# Altium schematic sheet 12mm_rotary_knob.SchDoc
size B; DocumentNumber: 5; SheetNumber: 5; SheetTotal: 6
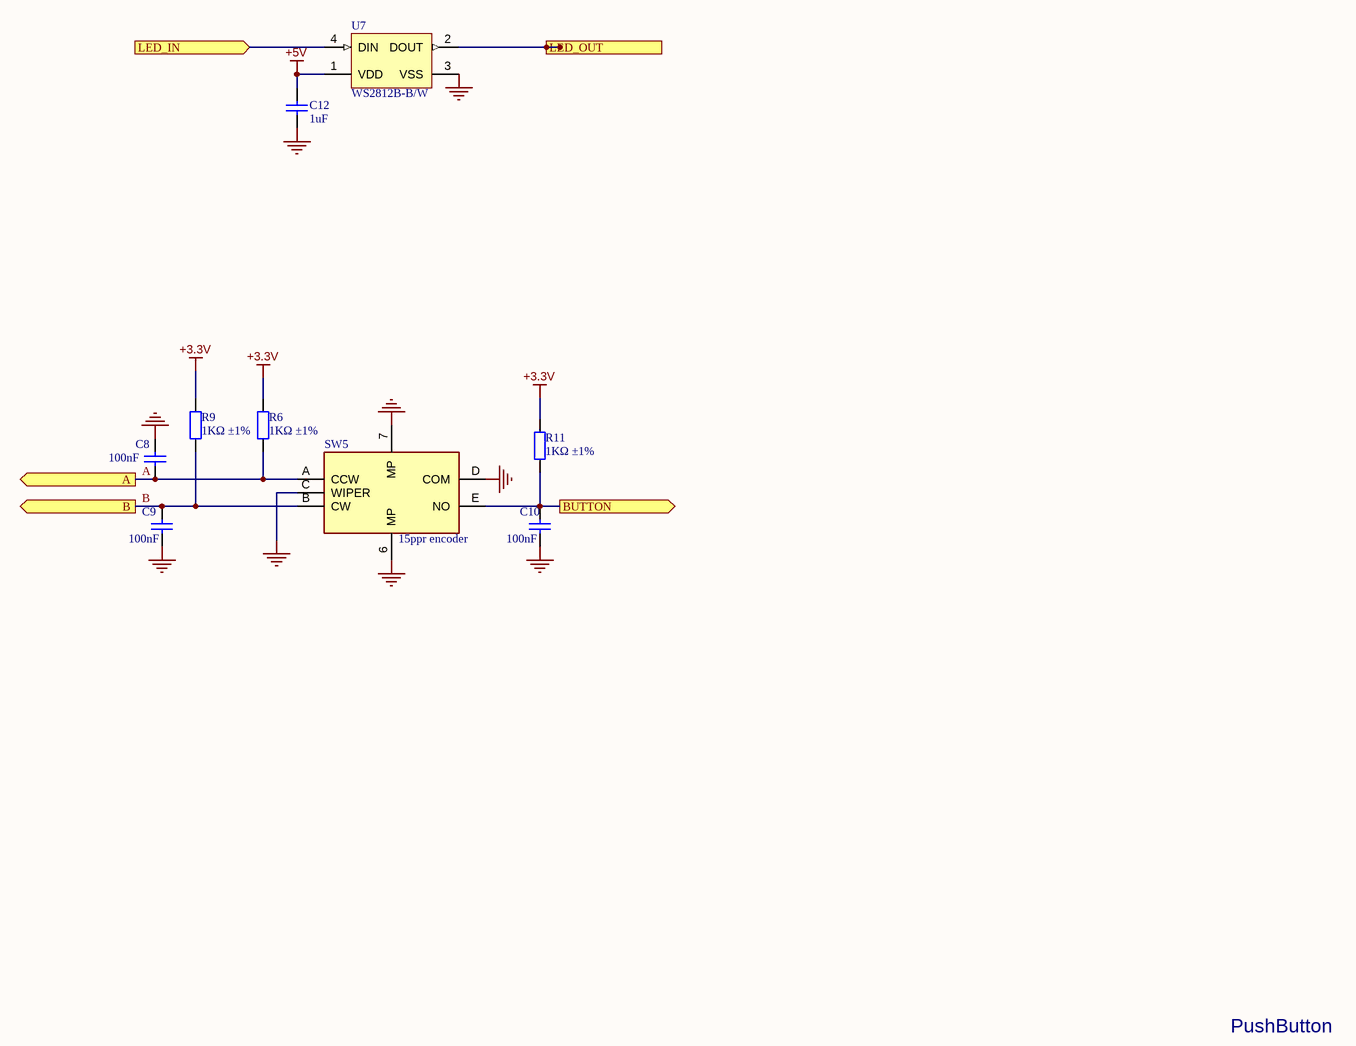
[diagram p0: 12mm_rotary_knob.SchDoc]

## Parts
C8  100nF  [0603_C]
C9  100nF  [0603_C]
C10  100nF  [0603_C]
C12  1uF  [0603_C]
R6  1KΩ ±1%  [0603_R]
R9  1KΩ ±1%  [0603_R]
R11  1KΩ ±1%  [0603_R]
SW5  15ppr encoder  [SW-TH_EC11E15244G1]
U7  WS2812B-B/W  [ADA-RGB-1655_V]

## Ports
A (out), B (out), BUTTON (out), LED_IN (in), LED_OUT (out)

## Nets
+3.3V: R6.1 R9.1 R11.1
+5V: C12.2 U7.1(VDD)
GND: C8.2 C9.1 C10.1 C12.1 SW5.6(MP) SW5.7(MP) SW5.C(WIPER) SW5.D(COM) U7.3(VSS)
A: C8.1 R6.2 SW5.A(CCW) ; port A
B: C9.2 R9.2 SW5.B(CW) ; port B
BUTTON: C10.2 R11.2 SW5.E(NO) ; port BUTTON
LED_IN: U7.4(DIN) ; port LED_IN
LED_OUT: U7.2(DOUT) ; port LED_OUT

## Notes on the sheet
- PushButton
- SHEET
- Expatria Technologies
- 1136 Glade Court
- Port Coquitlam, BC V3B 1R5
- PROJECT
- SIZE
- ENGR
- MODIFIED
- DOCUMENT
- REV
- Copyright Expatria Technologies 2021.  This document describes Open Hardware and is licensed under the CERN-OHL-P  v2.  No warranty is implied or expressed.
- EMAIL: INFO@EXPATRIA.CA
- B
- /

## Library data of the parts
C8-C10 = 0603 100nF (104) 10% 50V: Chip capacitors; Manufacturer: YAGEO; PartNumber: CC0603KRX7R9BB104; Tolerance: 10%; Voltage: 50V; ComponentLink1Description: Supplier link; ComponentLink1URL: http://www.szlcsc.com/product/details_15331.html; Package: 0603; Supplier: LC; SuppliersPartNumber: C14663; Capacitance: 100nF
C12 = 0603 1uF (105) 10% 50V: Chip capacitors; Manufacturer: Samsung Electro-Mechanics; PartNumber: CL10A105KB8NNNC; Tolerance: 10%; Voltage: 50V; ComponentLink1Description: Supplier link; ComponentLink1URL: http://www.szlcsc.com/product/details_16531.html; Package: 0603; Supplier: LC; SuppliersPartNumber: C15849; Capacitance: 1uF
R6 R9 R11 = 0603 1K (1001) 1%: Chip resistor; Manufacturer: Uniroyal Elec; PartNumber: 0603WAF1001T5E; Power: 1/10W; ComponentLink1Description: Supplier link; ComponentLink1URL: http://www.szlcsc.com/product/details_21904.html; Package: 0603; Supplier: LC; SuppliersPartNumber: C21190; Resistance: 1KΩ; Tolerance: 1%
SW5 = EC11E15244G1: Plugin Rotary Encoders ROHS 11mm; Manufacturer_Name: ALPSALPINE; Height: 14mm; Manufacturer_Part_Number: EC11E15244G1; Supplier: LCSD; SuppliersPartNumber: C370970
U7 = CMP-2000-05026-1: Intelligent Control LED Integrated Light Source, 3.5 to 5.3 V, -25 to 80 degC, 4-Pin SMD, RoHS, Tape and Reel; Manufacturer: Worldsemi; Package Description: 4-Pin Surface Mount Device, Body 5 x 5 mm; SuppliersPartNumber: C2874885; Part_Number: WS2812B-B/W